# Altium schematic sheet MCU.SchDoc
size B
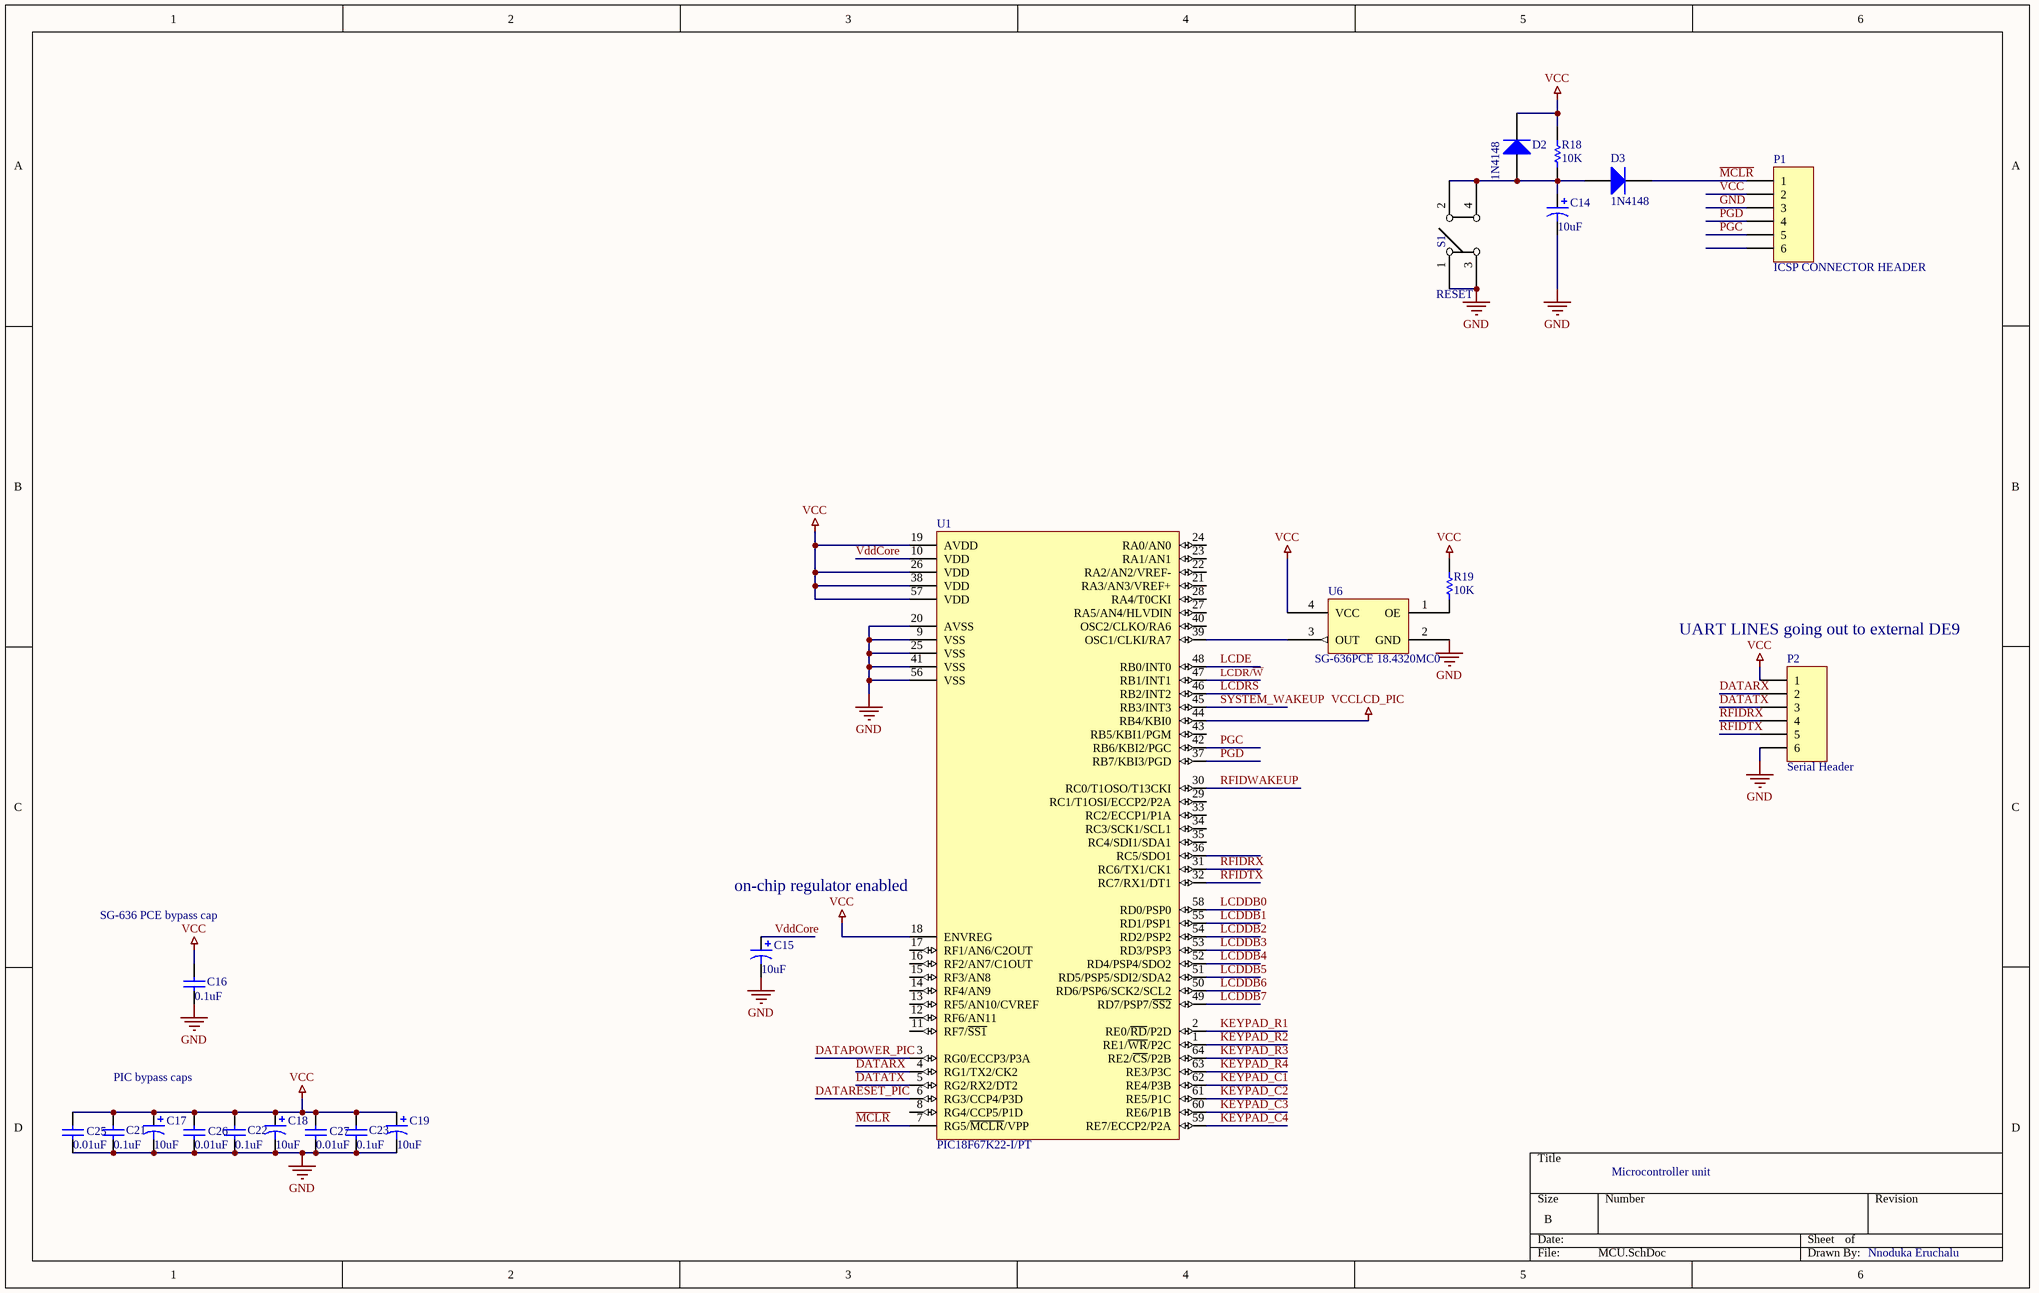
[diagram p0: MCU.SchDoc]

## Parts
C14  value 10uF  [3216[1206]]  (hidden comment: T520A106M010ATE080)
C15  value 10uF  [3216[1206]]  (hidden comment: T520A106M010ATE080)
C16  value 0.1uF  [2012[0805]]  (hidden comment: C2012X7R1H104K/0.85)
C17  value 10uF  [3216[1206]]  (hidden comment: T520A106M010ATE080)
C18  value 10uF  [3216[1206]]  (hidden comment: T520A106M010ATE080)
C19  value 10uF  [3216[1206]]  (hidden comment: T520A106M010ATE080)
C21  value 0.1uF  [2012[0805]]  (hidden comment: C2012X7R1H104K/0.85)
C22  value 0.1uF  [2012[0805]]  (hidden comment: C2012X7R1H104K/0.85)
C23  value 0.1uF  [2012[0805]]  (hidden comment: C2012X7R1H104K/0.85)
C25  value 0.01uF  [2012[0805]]  (hidden comment: C2012X7R2E103K)
C26  value 0.01uF  [2012[0805]]  (hidden comment: C2012X7R2E103K)
C27  value 0.01uF  [2012[0805]]  (hidden comment: C2012X7R2E103K)
D2  1N4148  [SOD123]
D3  1N4148  [SOD123]
P1  ICSP CONNECTOR HEADER  [HDR1X6]
P2  Serial Header  [HDR1X6]
R18  value 10K  [2012[0805]]  (hidden comment: ERJ-6GEYJ103V)
R19  value 10K  [2012[0805]]  (hidden comment: ERJ-6GEYJ103V)
S1  value RESET  [D6C]  (hidden comment: D6C00 F2 LFS)
U1  PIC18F67K22-I/PT  [TQFP-PT64_N]
U6  SG-636PCE 18.4320MC0  [SG-636PCE]

## Nets
GND: C14.2 C15.2 C16.1 C17.2 C18.2 C19.2 C21.1 C22.1 C23.1 C25.1 C26.1 C27.1 P1.3 P2.6 S1.1 S1.3 U1.9(VSS) U1.20(AVSS) U1.25(VSS) U1.41(VSS) U1.56(VSS) U6.2(GND)
VCC: C16.2 C17.1 C18.1 C19.1 C21.2 C22.2 C23.2 C25.2 C26.2 C27.2 D2.2(K) P1.2 P2.1 R18.1 R19.1 U1.18(ENVREG) U1.19(AVDD) U1.26(VDD) U1.38(VDD) U1.57(VDD) U6.4(VCC)
VCCLCD_PIC: U1.44(RB4/KBI0)
DATAPOWER_PIC: U1.3(RG0/ECCP3/P3A)
DATARESET_PIC: U1.6(RG3/CCP4/P3D)
DATARX: P2.2 U1.4(RG1/TX2/CK2)
DATATX: P2.3 U1.5(RG2/RX2/DT2)
KEYPAD_C1: U1.62(RE4/P3B)
KEYPAD_C2: U1.61(RE5/P1C)
KEYPAD_C3: U1.60(RE6/P1B)
KEYPAD_C4: U1.59(RE7/ECCP2/P2A)
KEYPAD_R1: U1.2(RE0/~{RD}/P2D)
KEYPAD_R2: U1.1(RE1/~{WR}/P2C)
KEYPAD_R3: U1.64(RE2/~{CS}/P2B)
KEYPAD_R4: U1.63(RE3/P3C)
LCDDB0: U1.58(RD0/PSP0)
LCDDB1: U1.55(RD1/PSP1)
LCDDB2: U1.54(RD2/PSP2)
LCDDB3: U1.53(RD3/PSP3)
LCDDB4: U1.52(RD4/PSP4/SDO2)
LCDDB5: U1.51(RD5/PSP5/SDI2/SDA2)
LCDDB6: U1.50(RD6/PSP6/SCK2/SCL2)
LCDDB7: U1.49(RD7/PSP7/~{SS2})
LCDE: U1.48(RB0/INT0)
LCDR/~{W}: U1.47(RB1/INT1)
LCDRS: U1.46(RB2/INT2)
~{MCLR}: D3.2(K) P1.1 U1.7(RG5/~{MCLR}/VPP)
PGC: P1.5 U1.42(RB6/KBI2/PGC)
PGD: P1.4 U1.37(RB7/KBI3/PGD)
RFIDRX: P2.4 U1.31(RC6/TX1/CK1)
RFIDTX: P2.5 U1.32(RC7/RX1/DT1)
RFIDWAKEUP: U1.30(RC0/T1OSO/T13CKI)
SYSTEM_WAKEUP: U1.45(RB3/INT3)
VddCore: C15.1 U1.10(VDD)
NetC14_1: C14.1 D2.1(A) D3.1(A) R18.2 S1.2 S1.4
NetR19_2: R19.2 U6.1(OE)
NetU1_39: U1.39(OSC1/CLKI/RA7) U6.3(OUT)

Not connected (* = marked no-connect by the designer): P1 6; U1 8(RG4/CCP5/P1D) 11(RF7/~{SS1}) 12(RF6/AN11) 13(RF5/AN10/CVREF) 14(RF4/AN9) 15(RF3/AN8) 16(RF2/AN7/C1OUT) 17(RF1/AN6/C2OUT) 21(RA3/AN3/VREF+) 22(RA2/AN2/VREF-) 23(RA1/AN1) 24(RA0/AN0) 27(RA5/AN4/HLVDIN) 28(RA4/T0CKI) 29(RC1/T1OSI/ECCP2/P2A) 33(RC2/ECCP1/P1A) 34(RC3/SCK1/SCL1) 35(RC4/SDI1/SDA1) 36(RC5/SDO1) 40(OSC2/CLKO/RA6) 43(RB5/KBI1/PGM)

## Notes on the sheet
- (near P2) UART LINES going out to external DE9
- (near U1) on-chip regulator enabled
- SG-636 PCE bypass cap
- PIC bypass caps
- Microcontroller unit
- Nnoduka Eruchalu

## Library data of the parts
C14 C15 C17-C19 = Cap Pol1: Polarized Capacitor (Radial); Published: 8-Jun-2000; LatestRevisionDate: 17-Jul-2002; LatestRevisionNote: Re-released for DXP Platform.; PackageReference: RB7.6-15; Publisher: Altium Limited
C16 C21-C23 C25-C27 = C0805: Ceramic Chip Capacitor - Standard; Note: Footprint corresponds to dimensions for bulk cassette packaging. This case size has tightened tolerances.; Published: 17-Jul-2002; LatestRevisionDate: 19-Mar-2004; LatestRevisionNote: Silkscreen size reduced.; DatasheetDocument: Mar-2001; PackageDocument: Mar-2001; PackageReference: 0805; Publisher: Altium Limited; Code_JEITA: 0805; Code_IPC: 2012[0805]; ComponentLink1Description: Manufacturer Link; ComponentLink1URL: http://www.kemet.com/; ComponentLink2Description: Datasheet; ComponentLink2URL: http://www.kemet.com/kemet/web/homepage/kechome.nsf/vapubfilesname/F3102TA.pdf/$file/F3102TA.pdf
D2 D3 = Diode 1N4148: High Conductance Fast Diode; Published: 8-Jun-2000; LatestRevisionDate: 17-Jul-2002; LatestRevisionNote: Re-released for DXP Platform.; DatasheetDocument: 1997; PackageReference: DO-35; Publisher: Altium Limited; Code_JEDEC: DO-204-AH; ComponentLink1Description: Manufacturer Link; ComponentLink1URL: http://www.fairchildsemi.com/; ComponentLink2Description: Datasheet; ComponentLink2URL: http://www.fairchildsemi.com/ds/1N%2F1N4148.pdf
P1 P2 = Header 6: Header, 6-Pin; LatestRevisionDate: 17-Jul-2002; LatestRevisionNote: Re-released for DXP Platform.; Publisher: Altium Limited
R18 R19 = Res1: Resistor; Published: 8-Jun-2000; LatestRevisionDate: 17-Jul-2002; LatestRevisionNote: Re-released for DXP Platform.; PackageReference: AXIAL-0.3; Publisher: Altium Limited
S1 = D6C
U1 = PIC18F6722-I/PT: 1-Mbit, Enhanced Flash Microcontroller with 10-Bit A/D and nanoWatt Technology, 128K Flash, 64-Pin TQFP, Industrial Temperature Range; Published: 29-Jan-2009; DatasheetVersion: revC, Oct-2008; PackageVersion: revBB, Aug-2009; PackageReference: TQFP-PT64; Publisher: Altium Limited; PackageDescription: 64-Lead Thin Plastic Quad Flat Pack (PT) - 10x10x1mm Body, 2.00mm [TQFP]; Supplier 1: Digi-Key; Supplier Part Number 1: PIC18F6722-I/PT-ND; Supplier 2: Farnell; Supplier Part Number 2: 8752966; Supplier 3: Farnell; Supplier Part Number 3: 1528416; Code_JEDEC: MS-026; ComponentLink1Description: Datasheet; ComponentLink1URL: http://ww1.microchip.com/downloads/en/DeviceDoc/39646c.pdf; ComponentLink2Description: Packaging Specification; ComponentLink2URL: http://www.microchip.com/stellent/groups/techpub_sg/documents/packagingspec/en012702.pdf; ComponentLink3Description: Microchip.com Home; ComponentLink3URL: http://www.microchip.com/
U6 = SG636PCE